# Altium schematic sheet MAZ000141 - Diagrama eléctrico.SchDoc: MAZ000141 - Diagrama eléctrico
size A; ApprovedBy: Omar Ortega; CheckedBy: Omar Ortega; Author: Nahuel Martinez; CompanyName: Body Health; DrawnBy: Nahuel Martinez; Revision: A; SheetNumber: 1; SheetTotal: 2
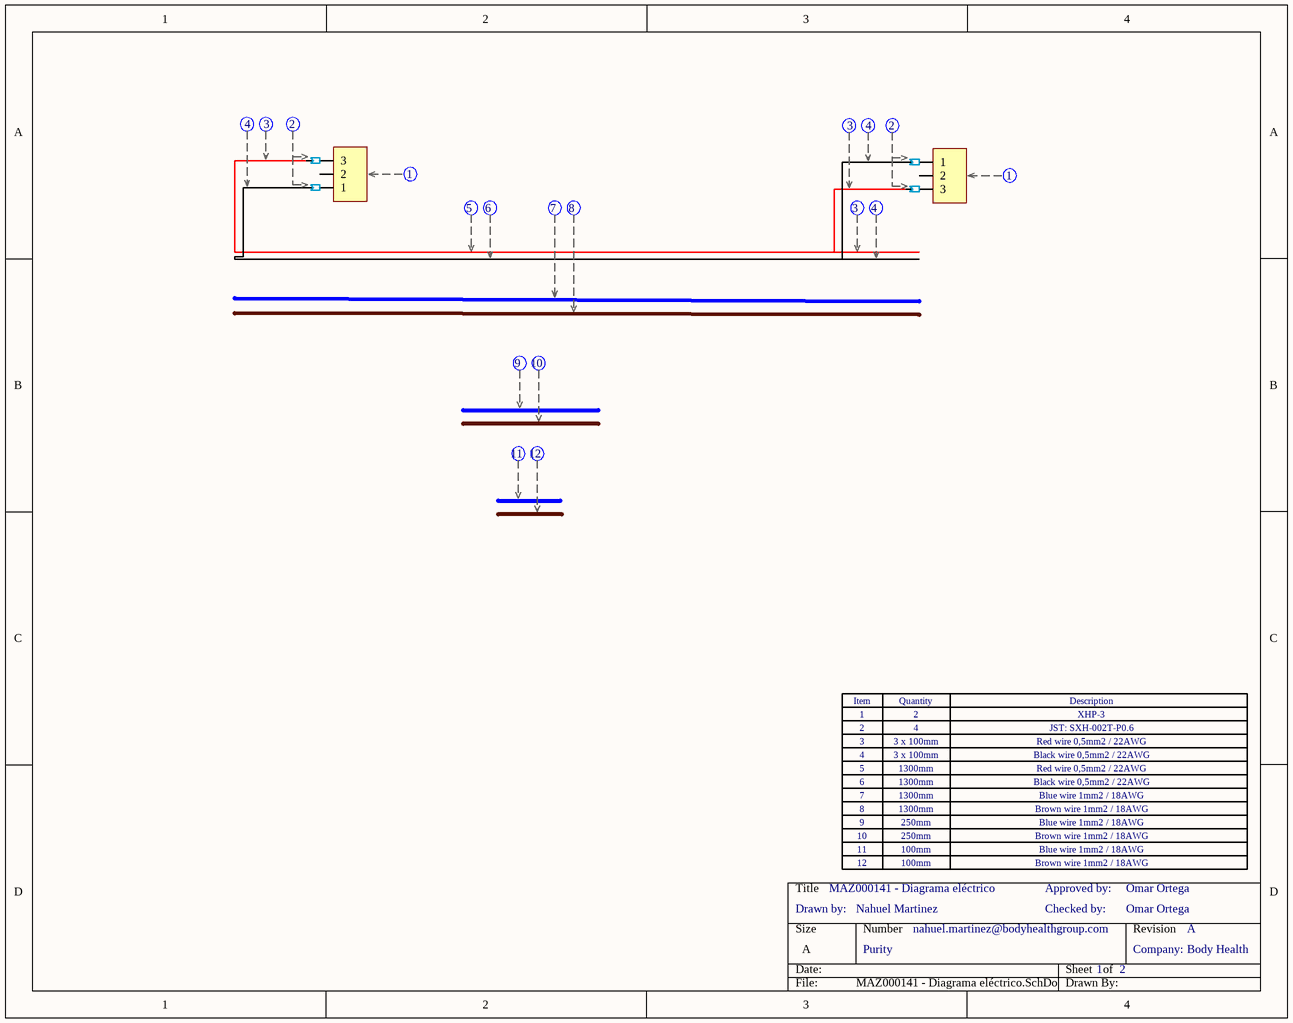
[diagram p0: MAZ000141 - Diagrama eléctrico.SchDoc]

## Parts
(Parts that share a designator on the sheet are numbered #1, #2 ... from top to bottom, then left to right.)
Con?#1  XHP-3  (value not drawn)  (part D of 4)
Con?#2  XHP-3  (value not drawn)  (part C of 4)
Con?#3  XHP-3  (value not drawn)  (part C of 4)
Con?#4  XHP-3  (value not drawn)  (part D of 4)
Soc?#1  sock_XHP_SXH-002T-P0.6  (value not drawn)  (part A of 2)
Soc?#2  sock_XHP_SXH-002T-P0.6  (value not drawn)  (part A of 2)
Soc?#3  sock_XHP_SXH-002T-P0.6  (value not drawn)  (part B of 2)
Soc?#4  sock_XHP_SXH-002T-P0.6  (value not drawn)  (part B of 2)
Soc?#5  sock_XHP_SXH-002T-P0.6  (value not drawn)  (part B of 2)
Soc?#6  sock_XHP_SXH-002T-P0.6  (value not drawn)  (part B of 2)
Ter?#1  Termocontraible  (value not drawn)
Ter?#2  Termocontraible  (value not drawn)
Ter?#3  Termocontraible  (value not drawn)
Ter?#4  Termocontraible  (value not drawn)
Ter?#5  Termocontraible  (value not drawn)
Ter?#6  Termocontraible  (value not drawn)
Ter?#7  Termocontraible  (value not drawn)
Ter?#8  Termocontraible  (value not drawn)
Ter?#9  Termocontraible  (value not drawn)
Ter?#10  Termocontraible  (value not drawn)
Ter?#11  Termocontraible  (value not drawn)
Ter?#12  Termocontraible  (value not drawn)
Ter?#13  Termocontraible  (value not drawn)
Ter?#14  Termocontraible  (value not drawn)
Zoc1  Zócalo_Header  (value not drawn)
Zoc?#1  Zócalo_Item  (value not drawn)
Zoc?#2  Zócalo_Item  (value not drawn)
Zoc?#3  Zócalo_Item  (value not drawn)
Zoc?#4  Zócalo_Item  (value not drawn)
Zoc?#5  Zócalo_Item  (value not drawn)
Zoc?#6  Zócalo_Item  (value not drawn)
Zoc?#7  Zócalo_Item  (value not drawn)
Zoc?#8  Zócalo_Item  (value not drawn)
Zoc?#9  Zócalo_Item  (value not drawn)
Zoc?#10  Zócalo_Item  (value not drawn)
Zoc?#11  Zócalo_Item  (value not drawn)
Zoc?#12  Zócalo_Item  (value not drawn)

## Nets
NetCon?#1_1: Con?#1.1 Soc?#5.1
NetCon?#1_3: Con?#1.3 Soc?#3.1
NetCon?#4_1: Con?#4.1 Soc?#4.1
NetCon?#4_3: Con?#4.3 Soc?#6.1

Not connected (* = marked no-connect by the designer): Con?#1 2; Con?#4 2; Soc?#3 0; Soc?#4 0; Soc?#5 0; Soc?#6 0

## Notes on the sheet
- 1
- (near Zoc?#1) 2
- (near Zoc?#2) 3
- (near Zoc?#3) 4
- (near Zoc?#4) 5
- (near Zoc?#5) 6
- 2
- 4
- (near Zoc?#2) 3 x 100mm
- (near Zoc?#3) 3 x 100mm
- 1300mm
- XHP-3
- JST: SXH-002T-P0.6
- Red wire 0,5mm2 / 22AWG
- Black wire 0,5mm2 / 22AWG
- (near Zoc?#10) 10
- (near Zoc?#9) 9
- (near Zoc?#6) 7
- (near Zoc?#7) 8
- 250mm
- Brown wire 1mm2 / 18AWG
- Blue wire 1mm2 / 18AWG
- (near Zoc?#12) Drawn by:
- (near Zoc?#12) 12
- (near Zoc?#10) 11
- 100mm
- Checked by:
- Approved by:
- Purity
- nahuel.martinez@bodyhealthgroup.com
- Company:
- (in symbol Zócalo_Header) Item; Quantity; Description

## Library data of the parts
Con?#1 Con?#4 = XHP-3: CONN HOUSING 2.5MM 3POS; Fabricante: JST Sales America Inc.; Cod.DigiKey: 455-2219-ND; Cod.Fabricante: XHP-3; ComponentLink1Description: Manufacturer Link; ComponentLink1URL: http://www.jst-mfg.com/product/pdf/eng/eXH.pdf; DIGIKEYx50: 0.06220; CallOut: *; DIGIKEYx100: NO
Con?#2 Con?#3 = XHP-3: CONN HOUSING 2.5MM 3POS; Fabricante: JST Sales America Inc.; CallOut: 1; Cod.DigiKey: 455-2219-ND; Cod.Fabricante: XHP-3; ComponentLink1Description: Manufacturer Link; ComponentLink1URL: http://www.jst-mfg.com/product/pdf/eng/eXH.pdf; DIGIKEYx50: 0.06220; DIGIKEYx100: NO
Soc?#1 Soc?#2 = sock_XHP_SXH-002T-P0.6: CONN SOCKET 26-30AWG CRIMP TIN; Fabricante: JST Sales America Inc.; CallOut: 2; Cod.DigiKey: 455-2261-1-ND; Cod.Fabricante: SXH-002T-P0.6; ComponentLink1Description: Manufacturer Link; ComponentLink1URL: http://www.jst-mfg.com/product/pdf/eng/eXH.pdf; DIGIKEYx100: 0.03300; DIGIKEYx50: 0.03420
Soc?#3-Soc?#6 = sock_XHP_SXH-002T-P0.6: CONN SOCKET 26-30AWG CRIMP TIN; Fabricante: JST Sales America Inc.; Cod.DigiKey: 455-2261-1-ND; Cod.Fabricante: SXH-002T-P0.6; ComponentLink1Description: Manufacturer Link; ComponentLink1URL: http://www.jst-mfg.com/product/pdf/eng/eXH.pdf; DIGIKEYx100: 0.03300; CallOut: *; DIGIKEYx50: 0.03420
Ter?#1 Ter?#4 Ter?#10 = Termocontraible: CallOut: 4; Largo: *; Diámetro: *
Ter?#2 Ter?#3 Ter?#9 = Termocontraible: CallOut: 3; Largo: *; Diámetro: *
Ter?#5 = Termocontraible: CallOut: 5; Largo: *; Diámetro: *
Ter?#6 = Termocontraible: CallOut: 6; Largo: *; Diámetro: *
Ter?#7 = Termocontraible: CallOut: 7; Largo: *; Diámetro: *
Ter?#8 = Termocontraible: CallOut: 8; Largo: *; Diámetro: *
Ter?#11 = Termocontraible: CallOut: 9; Largo: *; Diámetro: *
Ter?#12 = Termocontraible: CallOut: 10; Largo: *; Diámetro: *
Ter?#13 = Termocontraible: CallOut: 11; Largo: *; Diámetro: *
Ter?#14 = Termocontraible: CallOut: 12; Largo: *; Diámetro: *
Zoc1 = Zócalo_Header: Header para el zócalo de referencias
Zoc?#1-Zoc?#12 = Zócalo_Item: Ítem para el zócalo de referencias; Desginator: *; Quantity: *; ItemDescription: *